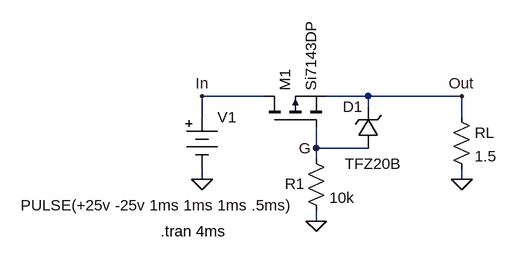
[diagram p0: schematic Reverse Protection - MOSFET.asc]
Reverse Protection - MOSFET.asc, the LTspice schematic file:
Version 4
SHEET 1 880 680
WIRE 176 96 80 96
WIRE 336 96 272 96
WIRE 480 96 336 96
WIRE 336 112 336 96
WIRE 80 128 80 96
WIRE 480 128 480 96
WIRE 256 176 256 144
WIRE 336 176 256 176
WIRE 256 192 256 176
WIRE 80 224 80 208
WIRE 480 224 480 208
WIRE 256 288 256 272
FLAG 256 288 0
FLAG 80 224 0
FLAG 480 224 0
FLAG 480 96 Out
FLAG 80 96 In
FLAG 256 176 G
SYMBOL pmos 176 144 R270
SYMATTR InstName M1
SYMATTR Value Si7143DP
SYMBOL res 240 176 R0
WINDOW 0 -32 55 Left 2
SYMATTR InstName R1
SYMATTR Value 10k
SYMBOL battery 80 112 R0
WINDOW 3 -279 152 Left 2
WINDOW 123 0 0 Left 2
WINDOW 39 0 0 Left 2
SYMATTR Value PULSE(+25v -25v 1ms 1ms 1ms .5ms)
SYMATTR InstName V1
SYMBOL res 464 112 R0
SYMATTR InstName RL
SYMATTR Value 1.5
SYMBOL zener 352 176 R180
WINDOW 0 24 64 Left 2
WINDOW 3 -36 -24 Left 2
SYMATTR InstName D1
SYMATTR Value TFZ20B
TEXT 16 304 Left 2 !.tran 4ms

The netlist it stands for:
* Reverse Protection - MOSFET.asc
M1 In G Out Out Si7143DP
R1 G 0 10k
V1 In 0 PULSE(+25v -25v 1ms 1ms 1ms .5ms)
RL Out 0 1.5
D1 G Out TFZ20B
.model D D
.lib standard.dio
.model NMOS NMOS
.model PMOS PMOS
.lib standard.mos
.tran 4ms
.backanno
.end